# Altium schematic sheet BiDirCurrentSensor.SchDoc
size A
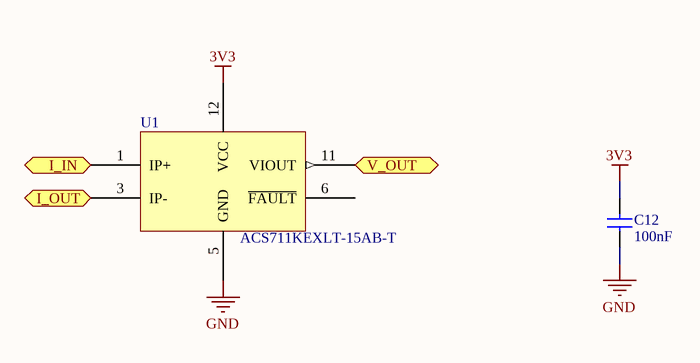
[diagram p0: BiDirCurrentSensor.SchDoc]

## Parts
C12  value 100nF  [CAPC0603]  (hidden comment: Cap)
U1  ACS711KEXLT-15AB-T  [ACS711KEXLT]

## Ports
I_IN (bidir), I_OUT (bidir), V_OUT (out)

## Nets
3V3: C12.2(B) U1.12(VCC)
GND: C12.1(A) U1.5(GND)
I_IN: U1.1(IP+) ; port I_IN
I_OUT: U1.3(IP-) ; port I_OUT
V_OUT: U1.11(VIOUT) ; port V_OUT

Not connected (* = marked no-connect by the designer): U1 6(~{FAULT})

## Library data of the parts
U1 = ACS711EEXLT: Hall Effect Linear Current Sensor with Overcurrent  Fault Output for < 100 V Isolation Applications; Supplier 1: Digi-Key; Supplier Part Number 1: 620-1483-1-ND
C12 = Cap: Supplier 1: Digi-Key; Supplier Part Number 1: 399-1095-1-ND